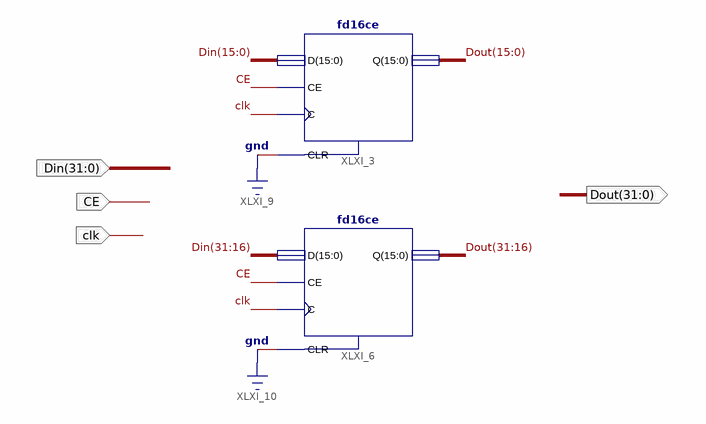
[diagram p0: schematic sheet 1]
// Xilinx ISE schematic FD32CE.sch (spartan2) as structural Verilog: 2 symbols, 4 ports
module FD32CE (
  input  CE,
  input  clk,
  input  [31:0] Din,
  output [31:0] Dout
);

  fd16ce XLXI_3 (.C(clk), .CE(CE), .CLR(1'b0), .D(Din[15:0]), .Q(Dout[15:0]));
  fd16ce XLXI_6 (.C(clk), .CE(CE), .CLR(1'b0), .D(Din[31:16]), .Q(Dout[31:16]));
endmodule
